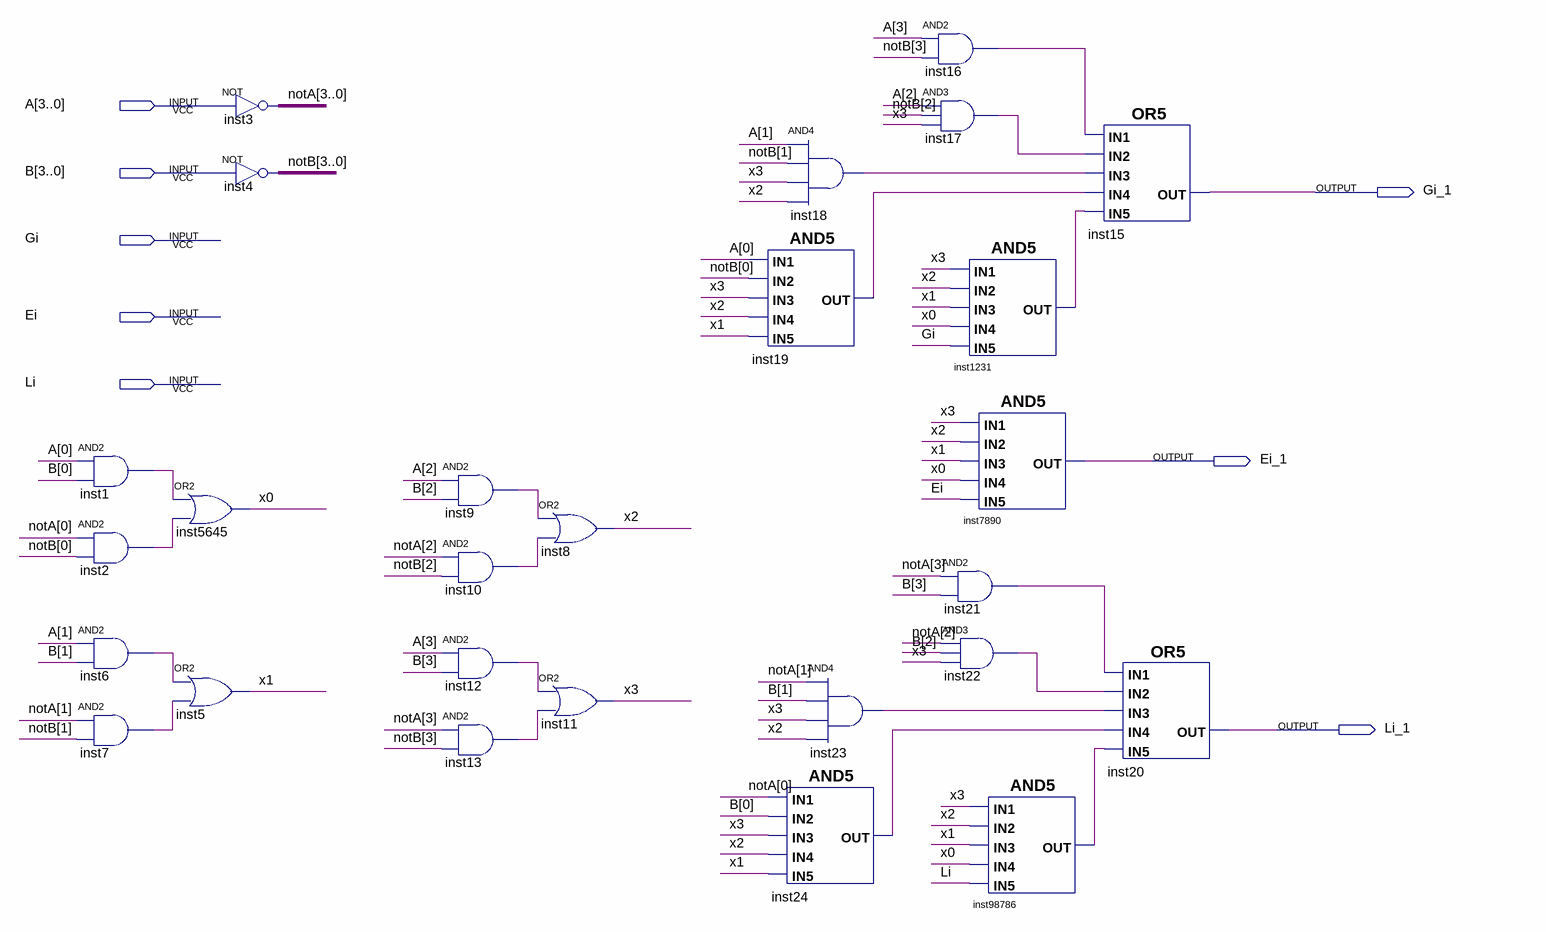
[diagram p0: schematic sheet]
// Quartus schematic cmp4.bdf as structural Verilog: 27 symbols, 8 pins
module cmp4 (
  input  [3:0] A,
  input  [3:0] B,
  input  Gi,
  input  Ei,
  input  Li,
  output Gi_1,
  output Ei_1,
  output Li_1
);

  wire inst1_out, inst2_out, inst6_out, inst7_out, inst9_out, inst10_out, inst12_out, inst13_out, inst16_out,
       inst17_out, inst18_out, inst19_out, inst21_out, inst22_out, inst23_out, inst24_out, inst1231_out,
       inst98786_out, x0, x1, x2, x3;
  wire [3:0] notA, notB;

  and inst1 (inst1_out, A[0], B[0]);
  and inst2 (inst2_out, notA[0], notB[0]);
  and inst6 (inst6_out, A[1], B[1]);
  and inst7 (inst7_out, notA[1], notB[1]);
  or inst5645 (x0, inst1_out, inst2_out);
  or inst5 (x1, inst6_out, inst7_out);
  assign notA = ~A;  // NOT inst3, 4 bits wide
  assign notB = ~B;  // NOT inst4, 4 bits wide
  and inst9 (inst9_out, A[2], B[2]);
  and inst10 (inst10_out, notA[2], notB[2]);
  and inst12 (inst12_out, A[3], B[3]);
  and inst13 (inst13_out, notA[3], notB[3]);
  or inst8 (x2, inst9_out, inst10_out);
  or inst11 (x3, inst12_out, inst13_out);
  and inst19 (inst19_out, A[0], notB[0], x3, x2, x1);
  and inst18 (inst18_out, A[1], notB[1], x3, x2);
  and inst23 (inst23_out, notA[1], B[1], x3, x2);
  and inst24 (inst24_out, notA[0], B[0], x3, x2, x1);
  and inst16 (inst16_out, A[3], notB[3]);
  and inst17 (inst17_out, A[2], notB[2], x3);
  and inst1231 (inst1231_out, x3, x2, x1, x0, Gi);
  and inst7890 (Ei_1, x3, x2, x1, x0, Ei);
  and inst21 (inst21_out, notA[3], B[3]);
  and inst22 (inst22_out, notA[2], B[2], x3);
  and inst98786 (inst98786_out, x3, x2, x1, x0, Li);
  or inst15 (Gi_1, inst16_out, inst17_out, inst18_out, inst19_out, inst1231_out);
  or inst20 (Li_1, inst21_out, inst22_out, inst23_out, inst24_out, inst98786_out);
endmodule
